# Altium schematic sheet Power_981228.SchDoc: RemoteReceiver
size A; SheetNumber: 1; SheetTotal: 1; Time: 981228
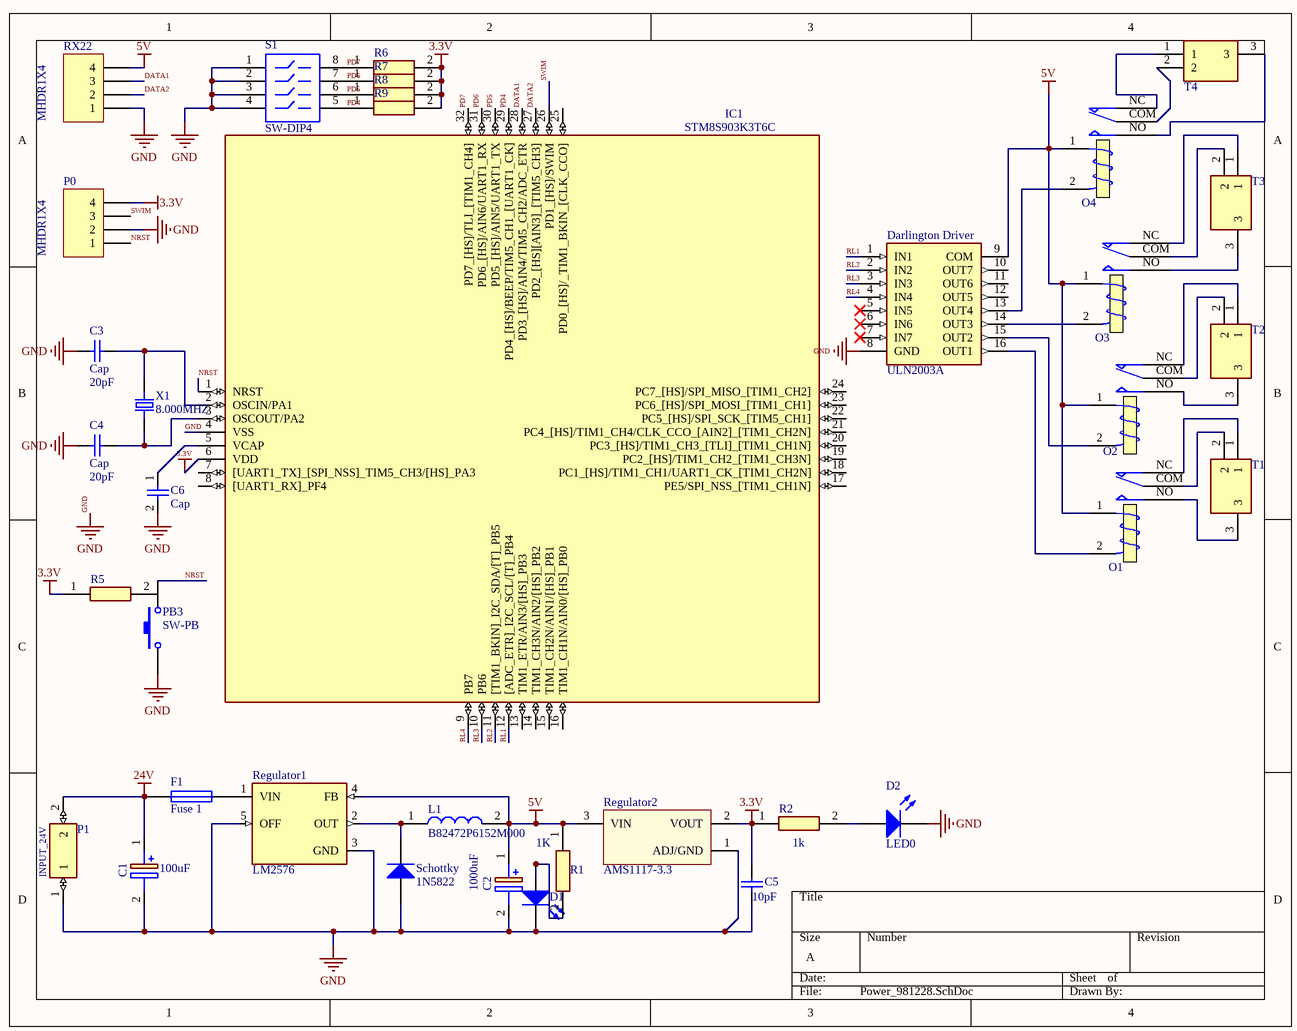
[diagram p0: Power_981228.SchDoc]

## Parts
C1  100uF  [CAPPRD550W60D1050H2150]
C2  1000uF  [CAPPRD550W60D1050H2150]
C3  Cap  value 20pF  [RAD-0.3]
C4  Cap  value 20pF  [RAD-0.3]
C5  value 10pF  [RAD-0.3]  (hidden comment: Cap)
C6  Cap  [RAD-0.3]
D1  LED0  [LED-0]  (value not drawn)
D2  LED0  [LED-0]
Darlington_Driver  ULN2003A  [DIP794W56P254L1918H533Q16N]
F1  Fuse 1  [PIN-W2/E2.8]
IC1  STM8S903K3T6C  [QFP80P900X900X160-32N]
L1  B82472P6152M000  [INDPM7474X450N]
O1  12V SMALL  [Relay_5_Small]  (value not drawn)
O2  12V SMALL  [Relay_5_Small]  (value not drawn)
O3  12V SMALL  [Relay_5_Small]  (value not drawn)
O4  12V SMALL  [Relay_5_Small]  (value not drawn)
P0  MHDR1X4  [MHDR1X4]
P1  INPUT_24V  [1725656]
PB3  SW-PB  [SPST-2]
R1  1K  [RESC3216X60N]
R2  1k  [RESC3216X60N]
R5  CRCW120610M0FKEA  [RESC3216X60N]  (value not drawn)
R6  CRCW120610M0FKEA  [RESC3216X60N]  (value not drawn)
R7  CRCW120610M0FKEA  [RESC3216X60N]  (value not drawn)
R8  CRCW120610M0FKEA  [RESC3216X60N]  (value not drawn)
R9  CRCW120610M0FKEA  [RESC3216X60N]  (value not drawn)
Regulator1  LM2576  [TO220-5]
Regulator2  AMS1117-3.3  [SOT229P700X180-4N]
RX22  MHDR1X4  [MHDR1X4]
S1  SW-DIP4  [DIP-8]
Schottky  1N5822  [DO-41]
T1  1725669  [1725669]  (value not drawn)
T2  1725669  [1725669]  (value not drawn)
T3  1725669  [1725669]  (value not drawn)
T4  1725669  [1725669]  (value not drawn)
X1  8.000MHZ  [XTAL_ABLS-8.000MHZ-B2-T]

## Nets
3.3V: C5.1 IC1.6(VDD) P0.4 R2.1 R5.1 R6.2 R7.2 R8.2 R9.2 Regulator2.2(VOUT)
5V: C2.1(+) Darlington_Driver.9(COM) L1.2 O1.1 O2.1 O3.1 O4.1 R1.1 Regulator1.4(FB) Regulator2.3(VIN) RX22.4
24V: C1.1(+) F1.1 P1.2
GND: C1.2(-) C2.2(-) C3.1 C4.1 C5.2 C6.2 D1.2(K) D2.2(K) Darlington_Driver.8(GND) IC1.4(VSS) P0.2 P1.1 PB3.1 Regulator1.3(GND) Regulator1.5(OFF) Regulator2.1(ADJ/GND) RX22.1 S1.1 S1.2 S1.3 S1.4 Schottky.1(A)
DATA1: IC1.28(PD3_[HS]/AIN4/TIM5_CH2/ADC_ETR) RX22.3
DATA2: IC1.27(PD2_[HS][AIN3]_[TIM5_CH3]) RX22.2
NRST: IC1.1(NRST) P0.1 PB3.2
PD4: IC1.29(PD4_[HS]/BEEP/TIM5_CH1_[UART1_CK]) R9.1 S1.5
PD5: IC1.30(PD5_[HS]/AIN5/UART1_TX) R8.1 S1.6
PD6: IC1.31(PD6_[HS]/AIN6/UART1_RX) R7.1 S1.7
PD7: IC1.32(PD7_[HS]/TLI_[TIM1_CH4]) R6.1 S1.8
RL1: Darlington_Driver.1(IN1) IC1.12([ADC_ETR]_I2C_SCL/[T]_PB4)
RL2: Darlington_Driver.2(IN2) IC1.11([TIM1_BKIN]_I2C_SDA/[T]_PB5)
RL3: Darlington_Driver.3(IN3) IC1.10(PB6)
RL4: Darlington_Driver.4(IN4) IC1.9(PB7)
SWIM: IC1.26(PD1_[HS]/SWIM) P0.3
NetC3_2: C3.2 IC1.2(OSCIN/PA1) X1.2
NetC4_2: C4.2 IC1.3(OSCOUT/PA2) X1.1
NetC6_1: C6.1 IC1.5(VCAP)
NetD1_1: D1.1(A) R1.2
NetD2_1: D2.1(A) R2.2
NetDarlington_Driver_13: Darlington_Driver.13(OUT4) O4.2
NetDarlington_Driver_14: Darlington_Driver.14(OUT3) O3.2
NetDarlington_Driver_15: Darlington_Driver.15(OUT2) O2.2
NetDarlington_Driver_16: Darlington_Driver.16(OUT1) O1.2
NetF1_2: F1.2 Regulator1.1(VIN)
NetL1_1: L1.1 Regulator1.2(OUT) Schottky.2(K)
NetO1_COM: O1.COM T1.2
NetO1_NC: O1.NC T1.1
NetO1_NO: O1.NO T1.3
NetO2_COM: O2.COM T2.2
NetO2_NC: O2.NC T2.1
NetO2_NO: O2.NO T2.3
NetO3_COM: O3.COM T3.2
NetO3_NC: O3.NC T3.1
NetO3_NO: O3.NO T3.3
NetO4_COM: O4.COM T4.2
NetO4_NC: O4.NC T4.1
NetO4_NO: O4.NO T4.3

Not connected (* = marked no-connect by the designer): Darlington_Driver 5(IN5)* 6(IN6)* 7(IN7)* 10(OUT7) 11(OUT6) 12(OUT5); IC1 7([UART1_TX]_[SPI_NSS]_TIM5_CH3/[HS]_PA3) 8([UART1_RX]_PF4) 13(TIM1_ETR/AIN3/[HS]_PB3) 14(TIM1_CH3N/AIN2/[HS]_PB2) 15(TIM1_CH2N/AIN1/[HS]_PB1) 16(TIM1_CH1N/AIN0/[HS]_PB0) 17(PE5/SPI_NSS_[TIM1_CH1N]) 18(PC1_[HS]/TIM1_CH1/UART1_CK_[TIM1_CH2N]) 19(PC2_[HS]/TIM1_CH2_[TIM1_CH3N]) 20(PC3_[HS]/TIM1_CH3_[TLI]_[TIM1_CH1N]) 21(PC4_[HS]/TIM1_CH4/CLK_CCO_[AIN2]_[TIM1_CH2N]) 22(PC5_[HS]/SPI_SCK_[TIM5_CH1]) 23(PC6_[HS]/SPI_MOSI_[TIM1_CH1]) 24(PC7_[HS]/SPI_MISO_[TIM1_CH2]) 25(PD0_[HS]/_TIM1_BKIN_[CLK_CCO]); R5 2

## Library data of the parts
C1 C2 = 108CKE025M: Capacitor Polarised; Manufacturer_Name: Cinch; Datasheet Link: https://componentsearchengine.com/Datasheets/2/108CKE025M.pdf; Height: 21.5mm; Manufacturer_Part_Number: 108CKE025M
C3-C6 = Cap: Capacitor; Published: 8-Jun-2000; LatestRevisionDate: 17-Jul-2002; LatestRevisionNote: Re-released for DXP Platform.; PackageReference: RAD-0.3; Publisher: Altium Limited; PackageDescription: Radial Cap, Thru-Hole; 2 Leads; 0.3 in Pin Spacing
D1 D2 = LED0: Typical INFRARED GaAs LED; Published: 8-Jun-2000; LatestRevisionDate: 08-Jul-2005; LatestRevisionNote: Mech Layer 1 removed.; PackageReference: LED-0; Publisher: Altium Limited; PackageDescription: LED; 2 Leads
Darlington_Driver = ULN2003A: Integrated Circuit; Manufacturer_Name: STMicroelectronics; Allied_Number: 70014189; Datasheet Link: http://www.st.com/web/en/resource/technical/document/datasheet/CD00001244.pdf; Height: 5.33mm; Manufacturer_Part_Number: ULN2003A; Mouser Part Number: 511-ULN2003A; Mouser Price/Stock: https://www.mouser.com/Search/Refine.aspx?Keyword=511-ULN2003A; RS Part Number: 6868209; RS Price/Stock: http://uk.rs-online.com/web/p/products/6868209; Allied Price/Stock: http://www.alliedelec.com/stmicroelectronics-uln2003a/70014189/
F1 = Fuse 1: Fuse; Published: 8-Jun-2000; LatestRevisionDate: 17-Jul-2002; LatestRevisionNote: Re-released for DXP Platform.; PackageReference: PIN-W2/E2.8; Publisher: Altium Limited; PackageDescription: Thru-Hole; 2 Leads
IC1 = STM8S903K3T6C: Integrated Circuit; Manufacturer_Name: STMicroelectronics; Allied_Number: 70391238; Datasheet Link: http://www.st.com/st-web-ui/static/active/en/resource/technical/document/datasheet/CD00231332.pdf; Height: 1.6mm; Manufacturer_Part_Number: STM8S903K3T6C; Mouser Part Number: 511-STM8S903K3T6C; Mouser Price/Stock: https://www.mouser.com/Search/Refine.aspx?Keyword=511-STM8S903K3T6C; RS Part Number: 7250025P; RS Price/Stock: http://china.rs-online.com/web/p/products/7250025P; Allied Price/Stock: http://www.alliedelec.com/stmicroelectronics-stm8s903k3t6c/70391238/
L1 = B82472P6152M000: Inductor; Manufacturer_Name: EPCOS; Datasheet Link: https://www.tdk-electronics.tdk.com/inf/30/db/ind_2008/b82472p6.pdf; Height: 4.5mm; Manufacturer_Part_Number: B82472P6152M000; Mouser Part Number: 871-B82472P6152M000; Mouser Price/Stock: https://www.mouser.com/Search/Refine.aspx?Keyword=871-B82472P6152M000
O1 = HJR-78F-12VDC-S-Z: Manufacturer: TIANBO; Manufacturer Part Number: STM8S003K3T6C; Rating: 7A, 120VAC; Interface: I2C,SPI,IrDA,UART,USART,LIN; RAM Size: 1KB; Max Frequency: 16MHz; Number of Timers/Counters: 7; Data Bus Width: 8b; Number of Programmable I/O: 28; Watchdog Timer: Yes; Memory Type: FLASH; Memory Size: 8KB; Max Supply Voltage: 5.5V; Min Supply Voltage: 2.95V; Max Power Dissipation: 330mW; Oscillator Type: Internal; Peripherals: Brown-out Detect/Reset,POR,PWM,WDT,I2C; Number of ADC Channels: 5; Number of SPI Channels: 1; Data Rate: 8Mbps; Link to Datasheet: *; Link to Picture: *; Operating Temp: -40°C to +85°C; Storage Temp: -40°C to +105°C; Tolerance: *; ComponentLink1Description: *; ComponentLink1URL: *; Manufacture Part #: HJR-78F-12VDC-S-Z; Value: 12V SMALL; Supplier 1: Future Electronics; Stock 1: 0; Mount: Surface Mount; Case/Package: LQFP; Number of Pins: 32; Min Operating Temperature: -40°C; Max Operating Temperature: 85°C; Packaging: Tray; Number of I/Os: 28; Package Quantity: 250; Frequency: 16MHz; Number of I2C Channels: 1; Number of UART Channels: 1; Length: 7.2mm; Height: 1.45mm; Width: 7.2mm; Radiation Hardening: No; Lead Free: Lead Free; REACH SVHC: No SVHC; ComponentLink2URL: http://www.st.com/web/en/resource/technical/document/datasheet/DM00024550.pdf?src-supplier=Future+Electronics; ComponentLink2Description: http://www.st.com/web/en/resource/technical/document/datasheet/DM00024550.pdf?src-supplier=Future+Electronics; ComponentLink3URL: http://www.st.com/web/en/resource/technical/document/datasheet/DM00024550.pdf?src-supplier=Avnet+Europe; ComponentLink3Description: http://www.st.com/web/en/resource/technical/document/datasheet/DM00024550.pdf?src-supplier=Avnet+Europe; ComponentLink4URL: http://www.st.com/web/en/resource/technical/document/datasheet/DM00024550.pdf?src-supplier=Mouser; ComponentLink4Description: http://www.st.com/web/en/resource/technical/document/datasheet/DM00024550.pdf?src-supplier=Mouser
O2-O4 = HJR-78F-12VDC-S-Z: Manufacturer: TIANBO; Rating: 7A, 120VAC; Link to Datasheet: *; Link to Picture: *; Operating Temp: -40°C to +85°C; Storage Temp: -40°C to +105°C; Tolerance: *; ComponentLink1Description: *; ComponentLink1URL: *; Manufacture Part #: HJR-78F-12VDC-S-Z; Value: 12V SMALL
P0 RX22 = MHDR1X4: Header, 4-Pin; LatestRevisionDate: 17-Jul-2002; LatestRevisionNote: Re-released for DXP Platform.; Publisher: Altium Limited
P1 = 1725656: Connector; Manufacturer_Name: Phoenix Contact; Allied_Number: 70054335; Datasheet Link: https://www.phoenixcontact.com/online/portal/gb?uri=pxc-oc-itemdetail:pid=1725656&library=gben&tab=1; Height: 8mm; Manufacturer_Part_Number: 1725656; Mouser Part Number: 651-1725656; Mouser Price/Stock: https://www.mouser.com/Search/Refine.aspx?Keyword=651-1725656; RS Part Number: 3909023; RS Price/Stock: https://uk.rs-online.com/web/p/products/3909023; Allied Price/Stock: http://www.alliedelec.com/phoenix-contact-1725656/70054335/
PB3 = SW-PB: Switch; Published: 24-Mar-1999; LatestRevisionDate: 17-Jul-2002; LatestRevisionNote: Re-released for DXP Platform.; PackageReference: SPST-2; Publisher: Altium Limited; PackageDescription: Switch; 2 Leads
R1 R2 R5-R9 = CRCW120610M0FKEA: Resistor; Manufacturer_Name: Vishay; Allied_Number: 70204450; Height: 0.6mm; Manufacturer_Part_Number: CRCW120610M0FKEA; Mouser Part Number: 71-CRCW1206-10M-E3; Mouser Price/Stock: https://www.mouser.com/Search/Refine.aspx?Keyword=71-CRCW1206-10M-E3; Allied Price/Stock: https://www.alliedelec.com/vishay-dale-crcw120610m0fkea/70204450/
Regulator1 = LM2576: Buck Switching Regulator IC Positive Fixed 5V 1 Output 3A TO-263-6, DÂ²Pak _5 Leads + Tab_, TO-263BA; MF: Texas Instruments; Price: None; Package: TO-263-6 National Semiconductor; Value: *; MP: LM2576; Availability: Unavailable; SnapEDA_Link: https://www.snapeda.com/parts/LM2576/Texas%20Instruments/view-part/214937/?ref=snap
Regulator2 = AMS1117: Low-dropout regulator; Type: AMS1117-3.3
S1 = SW-DIP4: DIP Switch; Published: 24-Mar-1999; LatestRevisionDate: 17-Jul-2002; LatestRevisionNote: Re-released for DXP Platform.; PackageReference: DIP-8; Publisher: Altium Limited
Schottky = Diode 1N4001: 1 Amp General Purpose Rectifier; Published: 8-Jun-2000; LatestRevisionDate: 17-Jul-2002; LatestRevisionNote: Re-released for DXP Platform.; DatasheetVersion: 1998; PackageVersion: Aug-1999; PackageReference: DO-41; Publisher: Altium Limited; PackageDescription: Diode, Axial; Body 5.2 x 2.7 mm (LxDia. max), Lead Dia. 0.86 mm (max); Code_JEDEC: DO-204-AL; ComponentLink1Description: Manufacturer Link; ComponentLink1URL: http://www.fairchildsemi.com/; ComponentLink2Description: Datasheet; ComponentLink2URL: http://www.fairchildsemi.com/ds/1N%2F1N4001.pdf
T1-T4 = 1725669: Connector; Manufacturer_Name: Phoenix Contact; Allied_Number: 70054336; Datasheet Link: https://www.phoenixcontact.com/online/portal/gb?uri=pxc-oc-itemdetail:pid=1725669&library=gben&tab=1; Height: 8.5mm; Manufacturer_Part_Number: 1725669; Mouser Part Number: 651-1725669; Mouser Price/Stock: https://www.mouser.com/Search/Refine.aspx?Keyword=651-1725669; RS Part Number: 3909039; RS Price/Stock: https://uk.rs-online.com/web/p/products/3909039; Allied Price/Stock: http://www.alliedelec.com/phoenix-contact-1725669/70054336/
X1 = ABLS-8.000MHZ-B2-T: 8MHz Â±20ppm Crystal 18pF 80 Ohms HC-49/US; MF: Abracon LLC; Value: *; MP: ABLS-8.000MHZ-B2; Package: HC-49/US Abracon LLC; SnapEDA_Link: https://www.snapeda.com/parts/ABLS-8.000MHZ-B2/Abracon%20LLC/view-part/2753215/?ref=snap; Price: None; Availability: Unavailable